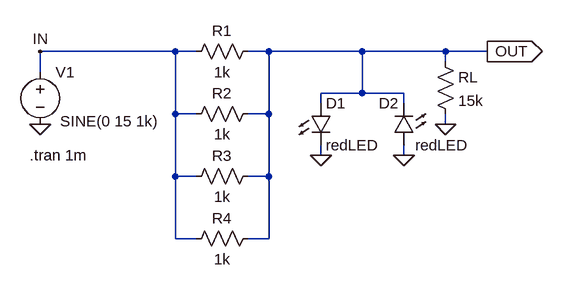
[diagram p0: schematic LED_Limiter_RL=15k_1kx4.asc]
LED_Limiter_RL=15k_1kx4.asc, the LTspice schematic file:
Version 4
SHEET 1 880 680
WIRE 192 80 -16 80
WIRE 224 80 192 80
WIRE 336 80 304 80
WIRE 480 80 336 80
WIRE 608 80 480 80
WIRE 672 80 608 80
WIRE 608 96 608 80
WIRE -16 112 -16 80
WIRE 480 144 480 80
WIRE 480 144 416 144
WIRE 544 144 480 144
WIRE 416 160 416 144
WIRE 544 160 544 144
WIRE 192 176 192 80
WIRE 224 176 192 176
WIRE 336 176 336 80
WIRE 336 176 304 176
WIRE 608 192 608 176
WIRE 416 240 416 224
WIRE 544 240 544 224
WIRE 192 272 192 176
WIRE 224 272 192 272
WIRE 336 272 336 176
WIRE 336 272 304 272
WIRE 192 368 192 272
WIRE 224 368 192 368
WIRE 336 368 336 272
WIRE 336 368 304 368
FLAG 672 80 OUT
IOPIN 672 80 Out
FLAG -16 192 0
FLAG 416 240 0
FLAG 544 240 0
FLAG -16 80 IN
FLAG 608 192 0
SYMBOL voltage -16 96 R0
WINDOW 3 31 91 Left 2
WINDOW 123 0 0 Left 2
WINDOW 39 0 0 Left 2
SYMATTR Value SINE(0 15 1k)
SYMATTR InstName V1
SYMBOL LED 400 160 R0
SYMATTR InstName D1
SYMATTR Value redLED
SYMBOL LED 560 224 R180
WINDOW 0 24 64 Left 2
WINDOW 3 -83 0 Left 2
SYMATTR InstName D2
SYMATTR Value redLED
SYMBOL res 320 64 R90
WINDOW 0 0 56 VBottom 2
WINDOW 3 32 56 VTop 2
SYMATTR InstName R1
SYMATTR Value 1k
SYMBOL res 592 80 R0
SYMATTR InstName RL
SYMATTR Value 15k
SYMBOL res 320 160 R90
WINDOW 0 0 56 VBottom 2
WINDOW 3 32 56 VTop 2
SYMATTR InstName R2
SYMATTR Value 1k
SYMBOL res 320 256 R90
WINDOW 0 0 56 VBottom 2
WINDOW 3 32 56 VTop 2
SYMATTR InstName R3
SYMATTR Value 1k
SYMBOL res 320 352 R90
WINDOW 0 0 56 VBottom 2
WINDOW 3 32 56 VTop 2
SYMATTR InstName R4
SYMATTR Value 1k
TEXT -32 240 Left 2 !.tran 1m

The netlist it stands for:
* LED_Limiter_RL=15k_1kx4.asc
V1 IN 0 SINE(0 15 1k)
D1 OUT 0 redLED
D2 0 OUT redLED
R1 OUT IN 1k
RL OUT 0 15k
R2 OUT IN 1k
R3 OUT IN 1k
R4 OUT IN 1k
.model D D
.lib standard.dio
.tran 1m
.backanno
.end